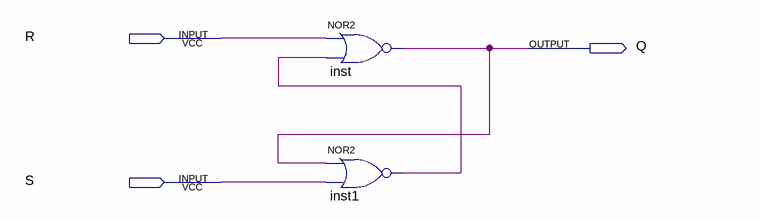
[diagram p0: schematic sheet]
// Quartus schematic sr_ff.bdf as structural Verilog: 2 symbols, 3 pins
module sr_ff (
  input  R,
  input  S,
  output Q
);

  wire inst1_out;

  nor inst (Q, R, inst1_out);
  nor inst1 (inst1_out, Q, S);
endmodule
